# EAGLE design main_controller (EAGLE 5.12)

## Sheet 1 of 2
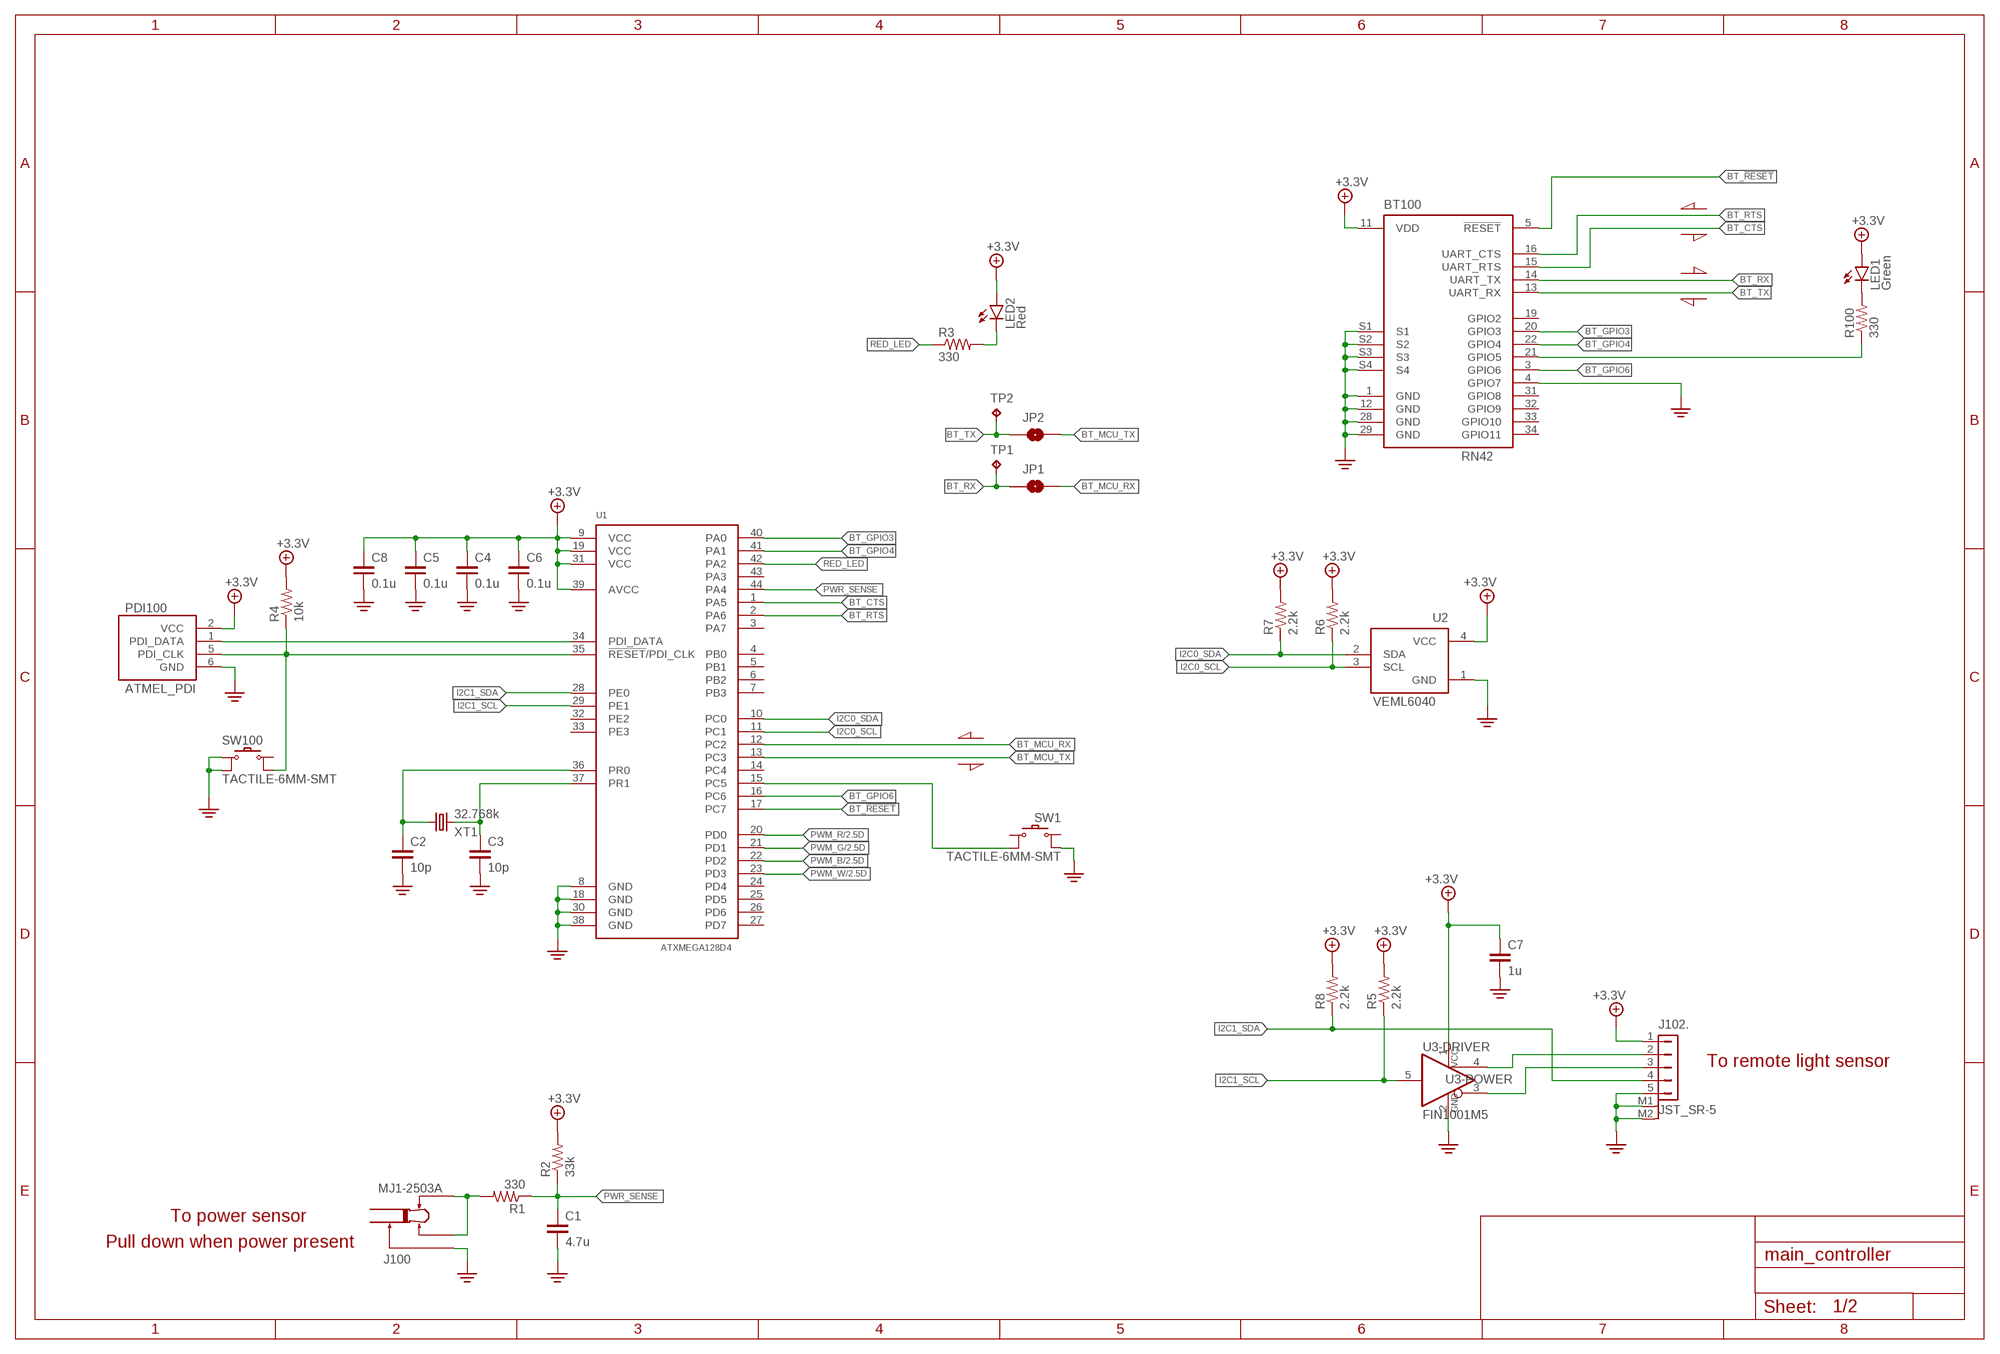
[diagram p0: schematic, sheet 1]

### Parts
BT100  RN42  [RN42]
C1  4.7u  C-CER-0805  [0805]
C2  10p  C-CER-0402  [0402]
C3  10p  C-CER-0402  [0402]
C4  0.1u  C-CER-0603  [0603]
C5  0.1u  C-CER-0603  [0603]
C6  0.1u  C-CER-0603  [0603]
C7  1u  C-CER-0603  [0603]
C8  0.1u  C-CER-0603  [0603]
J100  MJ1-2503A  [MJ1-2503A]
J102  JST_SR-5  [JST_SR-5]
JP1  JP  [SJ]
JP2  JP  [SJ]
LED1  Green  LED-1206  [1206]
LED2  Red  LED-0603  [0603]
PDI100  ATMEL_PDI  [2X03]
R1  330  R-0402  [0402]
R2  33k  R-0402  [0402]
R3  330  R-0805  [0805]
R4  10k  R-0402  [0402]
R5  2.2k  R-0402  [0402]
R6  2.2k  R-0402  [0402]
R7  2.2k  R-0402  [0402]
R8  2.2k  R-0402  [0402]
R100  330  R-0805  [0805]
SW1  TACTILE-6MM-SMT  [TACT-6MM-SMT]
SW100  TACTILE-6MM-SMT  [TACT-6MM-SMT]
TP1  TPTP20R  [TP20R]
TP2  TPTP20R  [TP20R]
U1  ATXMEGA128D4  [TQFP44]
U2  VEML6040  [VEML6040]
U3  FIN1001M5  [SOT23-5]
XT1  32.768k  XT-2.1X6MM  [2.1X6MM]

### Nets
3V3: BT100.11(VDD) C4.1 C5.1 C6.1 C7.1 C8.1 J102.1 LED1.A LED2.A PDI100.2(VCC) R2.2 R4.2 R5.2 R6.2 R7.2 R8.2 U1.9(VCC) U1.19(VCC) U1.31(VCC) U1.39(AVCC) U2.4(VCC) U3.1(-POWER:VCC) ; supply symbol labelled +3.3V ; also sheet 2
BT_!RESET: BT100.5(!RESET) U1.17(PC7)
BT_CTS: BT100.15(UART_RTS) U1.1(PA5)
BT_GPIO3: BT100.20(GPIO3) U1.40(PA0)
BT_GPIO4: BT100.22(GPIO4) U1.41(PA1)
BT_GPIO6: BT100.3(GPIO6) U1.16(PC6)
BT_MCU_RX: JP1.2 U1.12(PC2)
BT_MCU_TX: JP2.2 U1.13(PC3)
BT_RTS: BT100.16(UART_CTS) U1.2(PA6)
BT_RX: BT100.14(UART_TX) JP1.1 TP1.TP
BT_TX: BT100.13(UART_RX) JP2.1 TP2.TP
GND: BT100.1(GND) BT100.4(GPIO7) BT100.12(GND) BT100.28(GND) BT100.29(GND) BT100.S1 BT100.S2 BT100.S3 BT100.S4 C1.2 C2.2 C3.2 C4.2 C5.2 C6.2 C7.2 C8.2 J100.1(GND) J102.5 J102.M1(M) J102.M2(M) PDI100.6(GND) SW1.A2 SW100.A1 SW100.A2 U1.8(GND) U1.18(GND) U1.30(GND) U1.38(GND) U2.1(GND) U3.2(-POWER:GND) ; also sheet 2
I2C0_SCL: R6.1 U1.11(PC1) U2.3(SCL)
I2C0_SDA: R7.1 U1.10(PC0) U2.2(SDA)
I2C1_SCL: R5.1 U1.29(PE1) U3.5(-DRIVER:IN)
I2C1_SDA: J102.4 R8.1 U1.28(PE0)
N$7: BT100.21(GPIO5) R100.1
N$8: LED1.K(C) R100.2
N$9: LED2.K(C) R3.2
N$11: J100.2(MONO) J100.3(MONO) R1.2
N$12: PDI100.1(PDI_DATA) U1.34(PDI_DATA)
N$13: PDI100.5(PDI_CLK) R4.1 SW100.B2 U1.35(!RESET!/PDI_CLK)
N$14: C3.1 U1.37(PR1) XT1.2
N$15: C2.1 U1.36(PR0) XT1.1
N$20: SW1.B2 U1.15(PC5)
PWM_B: U1.22(PD2) ; also sheet 2
PWM_G: U1.21(PD1) ; also sheet 2
PWM_R: U1.20(PD0) ; also sheet 2
PWM_W: U1.23(PD3) ; also sheet 2
PWR_SENSE: C1.1 R1.1 R2.1 U1.44(PA4)
RED_LED: R3.1 U1.42(PA2)
SCL_N: J102.3 U3.3(-DRIVER:OUT-)
SCL_P: J102.2 U3.4(-DRIVER:OUT+)
Unconnected: BT100.19(GPIO2) BT100.31(GPIO8) BT100.32(GPIO9) BT100.33(GPIO10) BT100.34(GPIO11) SW1.A1 SW1.B1 SW100.B1 U1.3(PA7) U1.4(PB0) U1.5(PB1) U1.6(PB2) U1.7(PB3) U1.14(PC4) U1.24(PD4) U1.25(PD5) U1.26(PD6) U1.27(PD7) U1.32(PE2) U1.33(PE3) U1.43(PA3)

### Notes on the sheet
- To remote light sensor
- To power sensor
- Pull down when power present

## Sheet 2 of 2
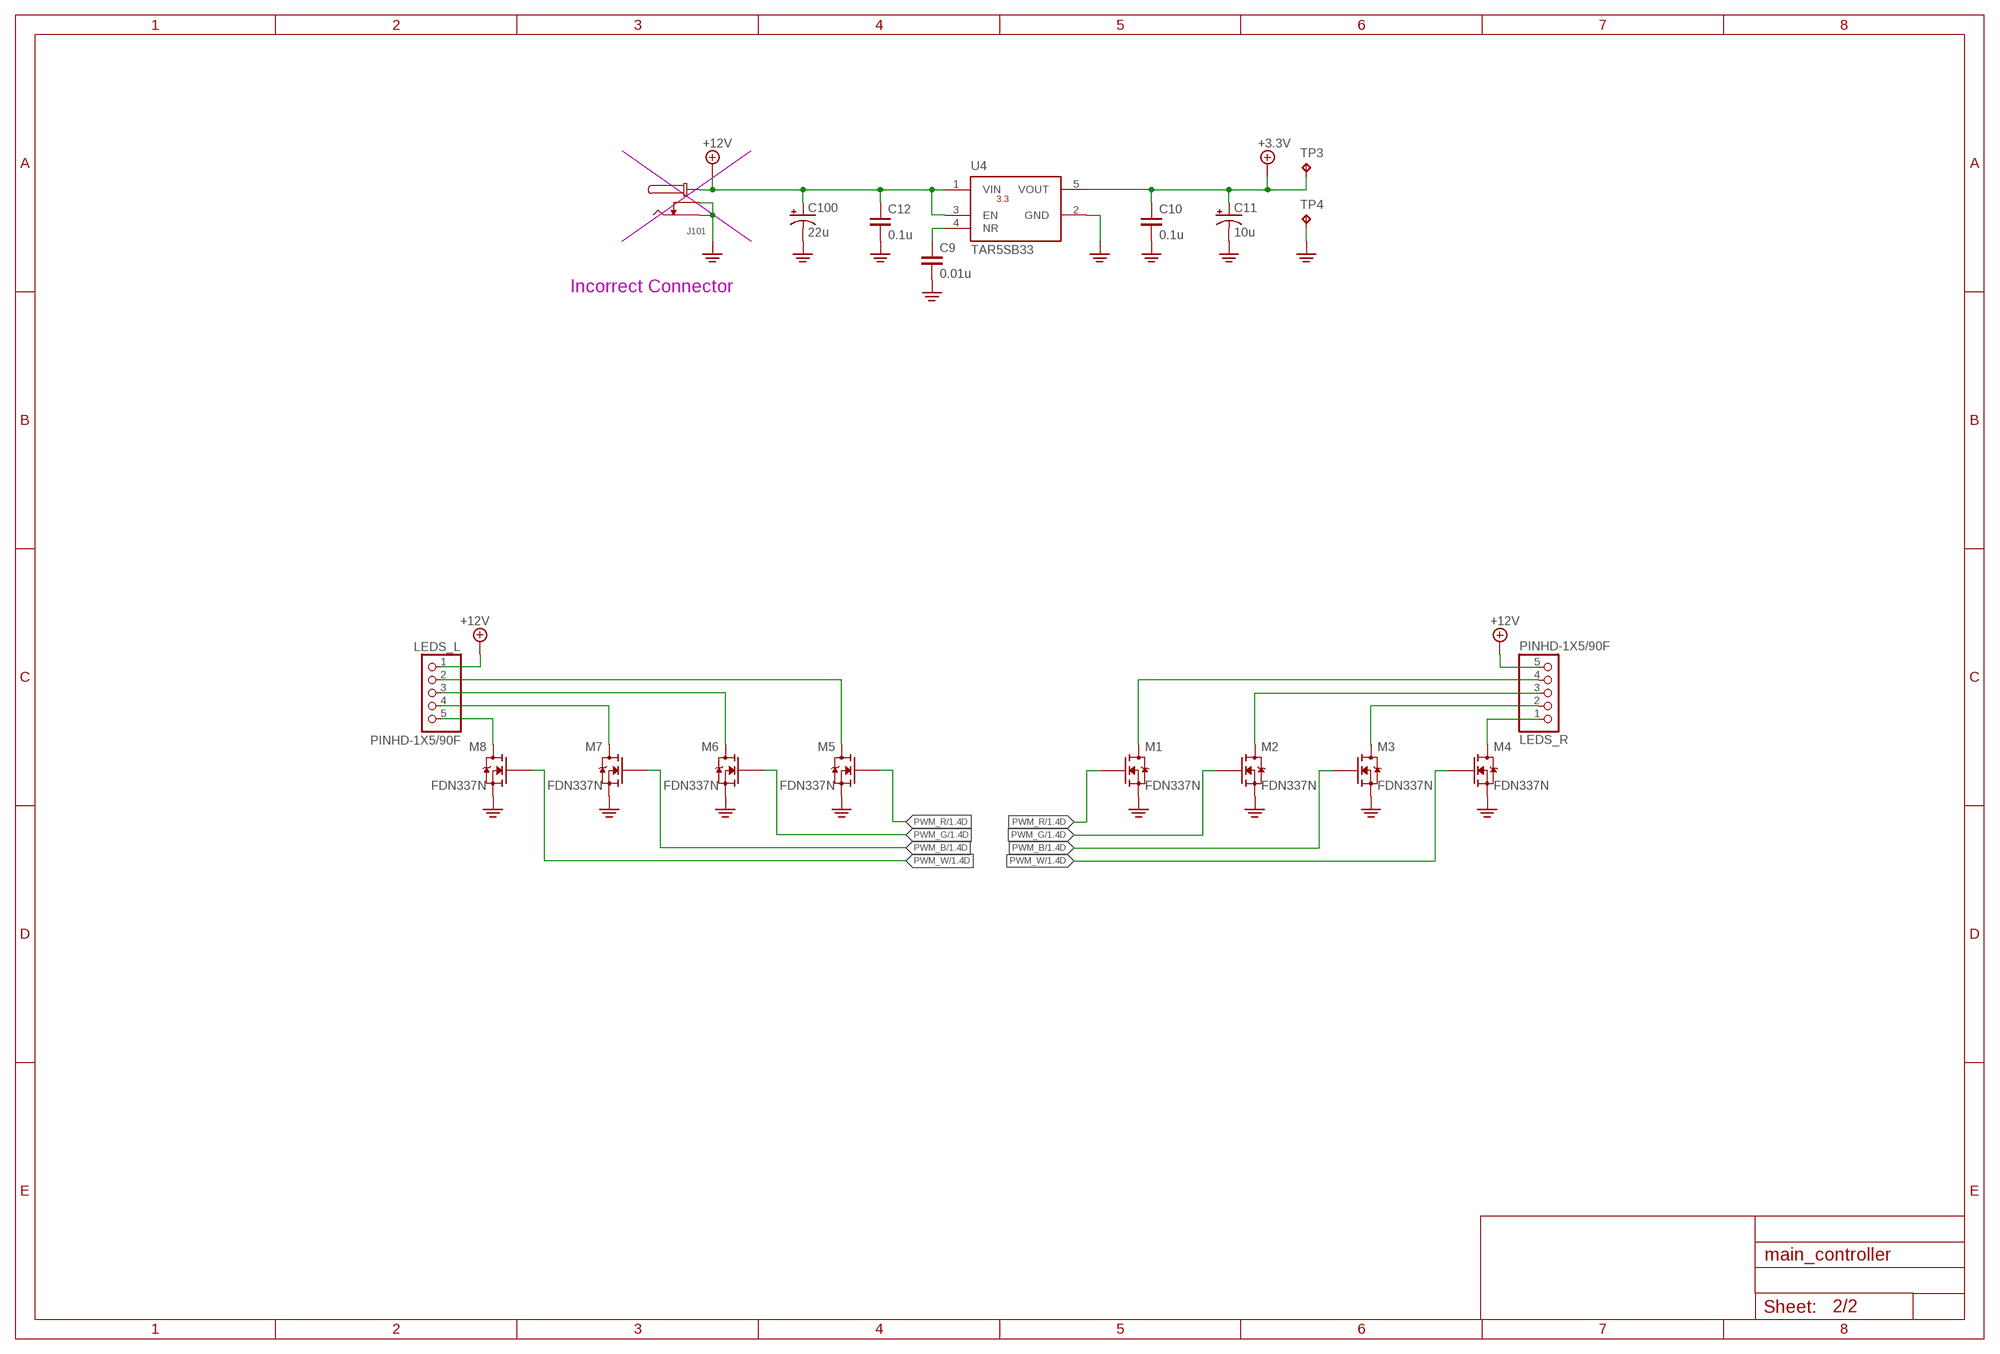
[diagram p1: schematic, sheet 2]

### Parts
C9  0.01u  C-CER-0603  [0603]
C10  0.1u  C-CER-0603  [0603]
C11  10u  C-TANT-3216-18  [KEMET-3216-18]
C12  0.1u  C-CER-1206  [1206]
C100  22u  C-AL-PAN-D  [PANASONIC_D]
J101  EIAJ-03  [PJ1-021-SMD]
LEDS_L  PINHD-1X5/90F  [1X05/90-F]
LEDS_R  PINHD-1X5/90F  [1X05/90-F]
M1  FDN337N  [SOT23]
M2  FDN337N  [SOT23]
M3  FDN337N  [SOT23]
M4  FDN337N  [SOT23]
M5  FDN337N  [SOT23]
M6  FDN337N  [SOT23]
M7  FDN337N  [SOT23]
M8  FDN337N  [SOT23]
TP3  TPTP20R  [TP20R]
TP4  TPTP20R  [TP20R]
U4  TAR5SB33  [SSOP5-P-0.95]

### Nets
3V3: C10.1 C11.+ TP3.TP U4.5(VOUT) ; supply symbol labelled +3.3V ; also sheet 1
12V: C12.1 C100.+ J101.1(CENTER) LEDS_L.1 LEDS_R.5 U4.1(VIN) U4.3(EN) ; supply symbol labelled +12V
GND: C9.2 C10.2 C11.- C12.2 C100.- J101.2(OUTSIDE) J101.3(SW) M1.2(S) M2.2(S) M3.2(S) M4.2(S) M5.2(S) M6.2(S) M7.2(S) M8.2(S) TP4.TP U4.2(GND) ; also sheet 1
N$2: LEDS_L.5 M8.3(D)
N$3: LEDS_L.4 M7.3(D)
N$4: LEDS_L.3 M6.3(D)
N$5: LEDS_L.2 M5.3(D)
N$10: C9.1 U4.4(NR)
N$16: LEDS_R.1 M4.3(D)
N$17: LEDS_R.2 M3.3(D)
N$18: LEDS_R.3 M2.3(D)
N$19: LEDS_R.4 M1.3(D)
PWM_B: M3.1(G) M7.1(G) ; also sheet 1
PWM_G: M2.1(G) M6.1(G) ; also sheet 1
PWM_R: M1.1(G) M5.1(G) ; also sheet 1
PWM_W: M4.1(G) M8.1(G) ; also sheet 1

### Notes on the sheet
- Incorrect Connector

## Library data of the parts
BT100 = aim-rf:RN42
C1-C10 C12 = aim-passives:C-CER
C11 = aim-passives:C-TANT
C100 = aim-passives:C-AL
J100 = aim-connectors:MJ1-2503A
J101 = aim-connectors:EIAJ-03: EIAJ-03 Jack
J102 = aim-connectors:JST_SR-5
JP1 JP2 = aim-passives:JP: SMD solder JUMPER
LED1 LED2 = aim-diodes:LED
LEDS_L LEDS_R = aim-headers:PINHD-1X5: PIN HEADER
M1-M8 = aim-transistor:FDN337N
PDI100 = aim-atmel:ATMEL_PDI: PIN HEADER
R1-R8 R100 = aim-passives:R
SW1 SW100 = aim-switch:TACTILE
TP1-TP4 = testpad:TP: Test pad
U1 = aim-atmel:ATXMEGA*D4
U2 = aim-sensors:VEML6040: Color sensor
U3 = aim-digital:FIN1001M5
U4 = aim-power:TAR5SB*; VOLT: 3.3
XT1 = aim-crystals:XT

## Board
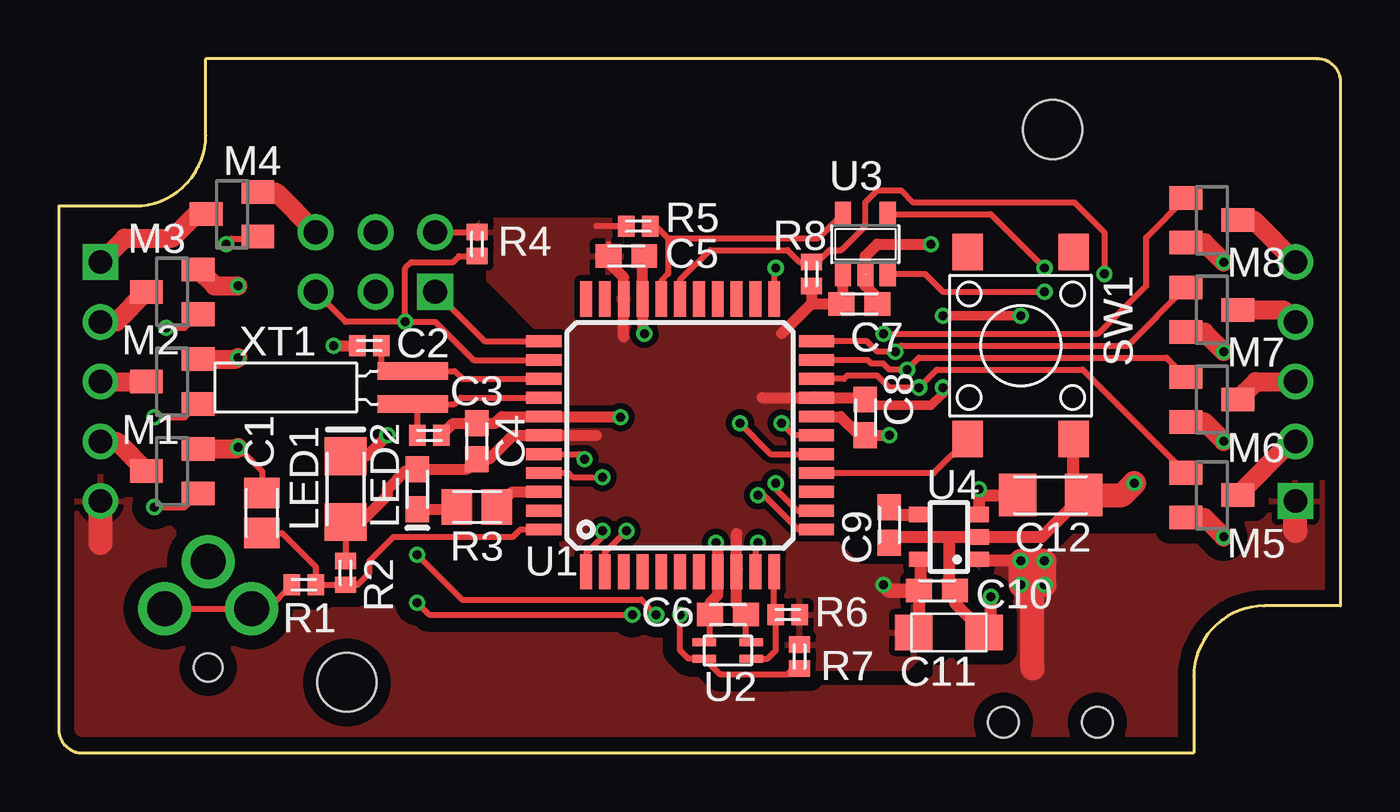
[diagram p2: board, top side]
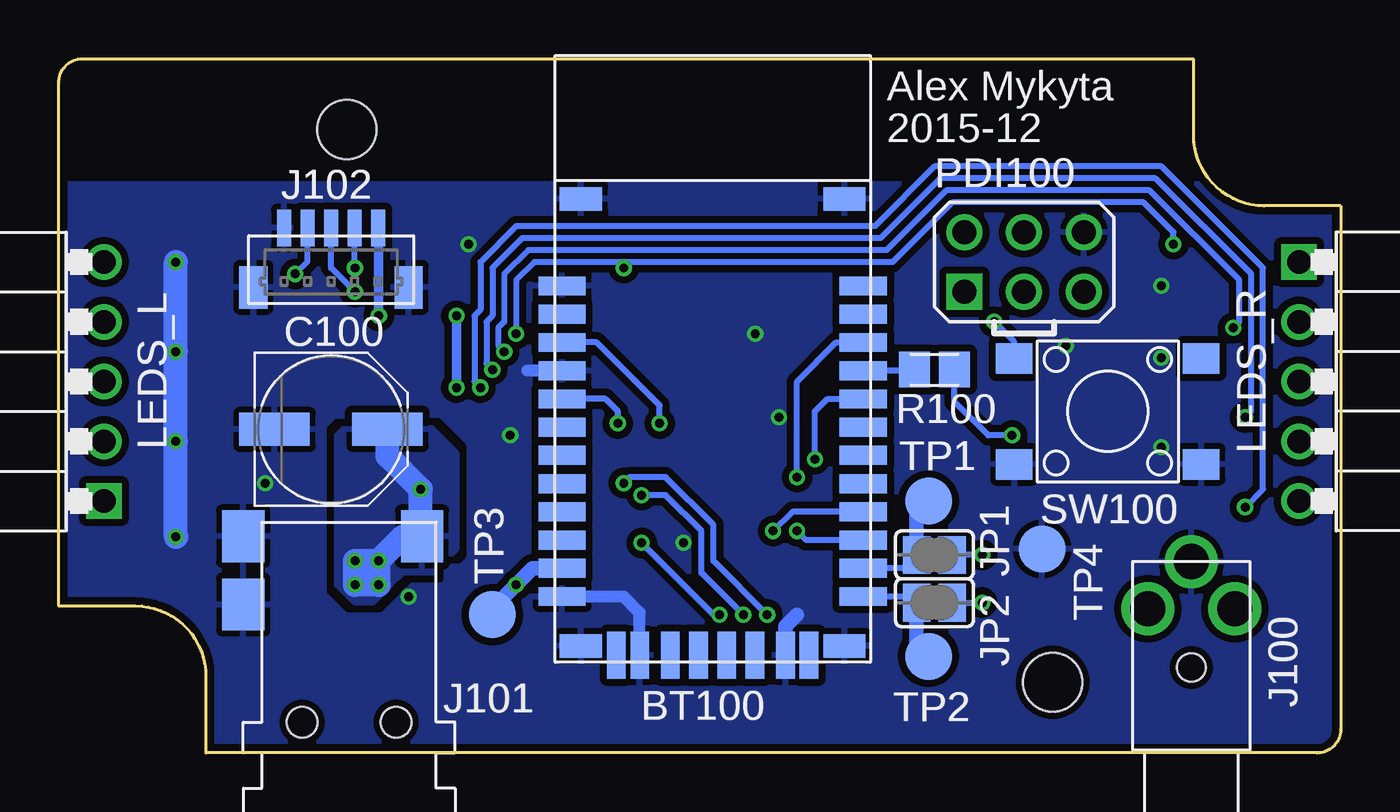
[diagram p3: board, bottom side, seen from below]

Size 54.5 x 29.5 mm. Coordinates in mm from the lower left corner, seen from the top.
Copper layers (1*16): Top 0.035mm / dielectric 1.5mm / Bottom 0.035mm
Design rules "MakerStudio": minimum track width 6mil, minimum drill 12mil, track to track 6mil, track to pad 6mil, pad to pad 6mil, via to via 6mil, smd to smd 0mil, copper to edge 10mil, drill to drill 10mil, minimum pad ring 10mil, minimum via ring 6mil, stop-mask expansion 2mil, vias tented up to drill 100mil, thermal gap 10mil

### Footprints (pad centres in the part's own frame; a part is rotated, then mirrored left to right if it is on the bottom)
RN42 = smd 2 x 0.8: 1 0.3,16; 2 0.3,14.8; 3 0.3,13.6; 4 0.3,12.4; 5 0.3,11.2; 6 0.3,10; 7 0.3,8.8; 8 0.3,7.6; 9 0.3,6.4; 10 0.3,5.2; 11 0.3,4; 12 0.3,2.8; 13 13.1,2.8; 14 13.1,4; 15 13.1,5.2; 16 13.1,6.4; 17 13.1,7.6; 18 13.1,8.8; 19 13.1,10; 20 13.1,11.2; 21 13.1,12.4; 22 13.1,13.6; 23 13.1,14.8; 24 13.1,16 | smd 0.8 x 2: 28 9.8,0.3; 29 3.6,0.3; 30 10.8,0.3; 31 8.5,0.3; 32 7.3,0.3; 33 6.1,0.3; 34 4.9,0.3; 35 2.6,0.3 | smd 1.8 x 1: S1 1.1,0.7; S2 12.3,0.7; S3 1.1,19.7; S4 12.3,19.7
0805 = smd 1.3 x 1.5: 1 -0.85,0; 2 0.85,0
0402 = smd 0.7 x 0.9: 1 -0.508,0; 2 0.508,0
0603 = smd 1.1 x 1: 1 -0.762,0; 2 0.762,0
KEMET-3216-18 = smd 1.6 x 1.5: + 1.5,0; - -1.5,0
1206 = smd 1.6 x 1.8: 1 -1.4,0; 2 1.4,0
PANASONIC_D = smd 3 x 1.4: + 2.4,0; - -2.4,0
MJ1-2503A = drill 1.5 round: 1 2,0; 2 0,-1.85; 3 0,1.85 | hole 1.2: -2.5,0
PJ1-021-SMD = smd 2.2 x 1.8: 1 7.9,-2.6; 2 5,5; 3 7.9,5 | hole 1.3: 0,2.5; 0,-1.5
JST_SR-5 = smd 0.6 x 1.55: 1 2,3.225; 2 1,3.225; 3 0,3.225; 4 -1,3.225; 5 -2,3.225 | smd 1.2 x 1.8: M1 3.3,0.7; M2 -3.3,0.7
SJ = smd 1.168 x 1.6: 1 -0.762,0; 2 0.762,0
1206' = smd 1.6 x 1.8: A -1.4,0; K 1.4,0
0603' = smd 1.1 x 1: A -0.85,0; K 0.85,0
1X05/90-F = drill 1 square: 1 -5.08,0 | drill 1 round: 2 -2.54,0; 3 0,0; 4 2.54,0; 5 5.08,0
SOT23 = smd 1 x 1.4: 1 -0.95,-1.1; 2 0.95,-1.1; 3 0,1.1
2X03 = drill 1.016 square: 1 -2.54,-1.27 | drill 1.016 round: 2 -2.54,1.27; 3 0,-1.27; 4 0,1.27; 5 2.54,-1.27; 6 2.54,1.27
TACT-6MM-SMT = smd 1.55 x 1.3: A1 -3.975,2.25; A2 3.975,2.25; B1 -3.975,-2.25; B2 3.975,-2.25
TP20R = smd 2 x 2: TP 0,0
TQFP44 = smd 1.5 x 0.5: 1 -5.8,4; 2 -5.8,3.2; 3 -5.8,2.4; 4 -5.8,1.6; 5 -5.8,0.8; 6 -5.8,0; 7 -5.8,-0.8; 8 -5.8,-1.6; 9 -5.8,-2.4; 10 -5.8,-3.2; 11 -5.8,-4; 23 5.8,-4; 24 5.8,-3.2; 25 5.8,-2.4; 26 5.8,-1.6; 27 5.8,-0.8; 28 5.8,0; 29 5.8,0.8; 30 5.8,1.6; 31 5.8,2.4; 32 5.8,3.2; 33 5.8,4 | smd 0.5 x 1.5: 12 -4,-5.8; 13 -3.2,-5.8; 14 -2.4,-5.8; 15 -1.6,-5.8; 16 -0.8,-5.8; 17 0,-5.8; 18 0.8,-5.8; 19 1.6,-5.8; 20 2.4,-5.8; 21 3.2,-5.8; 22 4,-5.8; 34 4,5.8; 35 3.2,5.8; 36 2.4,5.8; 37 1.6,5.8; 38 0.8,5.8; 39 0,5.8; 40 -0.8,5.8; 41 -1.6,5.8; 42 -2.4,5.8; 43 -3.2,5.8; 44 -4,5.8
VEML6040 = smd 1 x 0.35: 1 -1,0.35; 2 -1,-0.35; 3 1,-0.35; 4 1,0.35
SOT23-5 = smd 0.69 x 0.99: 1 -0.95,-1.29; 2 0,-1.29; 3 0.95,-1.29; 4 0.95,1.3; 5 -0.95,1.3
SSOP5-P-0.95 = smd 0.65 x 1: 1 -0.95,-1.2; 2 0,-1.2; 3 0.95,-1.2; 4 0.95,1.2; 5 -0.95,1.2
1551JFL = hole 2.5: 12.25,26.5; 42.25,3
2.1X6MM = smd 3 x 0.75: 1 5.4,0.7; 2 5.4,-0.7

### Placement (x,y rotation side)
BT100  33.4,3.85 0 bottom
C1  8.64,10.2 90 top
C2  13.21,17.31 180 top
C3  15.75,13.5 0 top
C4  17.78,13.24 90 top
C5  24.13,21.12 0 top
C6  28.45,5.88 180 top
C7  34.04,19.09 0 top
C8  34.29,14.26 270 top
C9  35.31,9.69 270 top
C10  37.34,6.89 0 top
C11  37.85,5.12 180 top
C12  42.16,10.96 0 top
C100  42.93,13.75 0 bottom
J100  6.35,6.13 90 bottom
J101  41.66,1.31 90 bottom
J102  42.93,19.09 0 bottom
JP1  17.27,8.42 0 bottom
JP2  17.27,6.39 0 bottom
LED1  Green  [1206']  12.19,11.21 90 top
LED2  Red  [0603']  15.24,11.21 270 top
LEDS_L  52.58,15.78 90 bottom
LEDS_R  1.78,15.78 270 bottom
M1  4.83,11.97 90 top
M2  4.83,15.78 90 top
M3  4.83,19.59 90 top
M4  7.37,22.9 90 top
M5  49.02,10.96 270 top
M6  49.02,15.02 270 top
M7  49.02,18.83 270 top
M8  49.02,22.64 270 top
PDI100  13.46,20.86 0 bottom
R1  10.41,7.15 180 top
R2  12.19,7.66 90 top
R3  17.78,10.45 180 top
R4  17.78,21.63 90 top
R5  24.64,22.39 180 top
R6  30.99,5.88 0 top
R7  31.5,4.1 90 top
R8  32,20.36 270 top
R100  17.27,16.29 0 bottom
SW1  40.89,17.31 270 top
SW100  9.91,14.51 180 bottom
TP1  17.53,10.7 0 bottom
TP2  17.53,4.1 0 bottom
TP3  36.07,5.88 0 bottom
TP4  12.7,8.67 0 bottom
U1  26.42,13.5 90 top
U2  28.45,4.35 0 top
U3  34.29,21.63 0 top
U4  37.85,9.18 90 top
U$100  [1551JFL]  0,29.5 180 bottom
XT1  9.65,15.53 0 top

### Tracks (layer width: path | path; a pad name or v marks a point on that pad's centre or on a via)
3V3  (via drill 0.38)
  Top 0.254: PDI100.2 R4.2 | LED1.A R2.2 | 15.15,11.97 LED2.A | C6.1 29.21,4.94 U2.4 | C5.1 23.37,21.63 | R5.2 22.86,22.39
  Top 0.406: v37.59,18.58 v40.89,18.58 | v37.59,15.53 37.59,15.28 37.08,14.77 34.54,14.77 C8.1
  Top 0.457: C5.1 23.37,20.86 24.02,20.22 U1.31 24.02,17.68 | 22.86,13.5 U1.39 19.3,13.5 18.29,12.48 C4.1 17.36,12.06 LED2.A | 29.9,15.1 U1.19 34.21,15.1 C8.1 | 28.82,9.32 U1.9 28.82,6.27 C6.1 | LED1.A 12.82,9.81 13.97,10.96 13.97,11.21 14.73,11.97 15.15,11.97 | R8.2 32,19.09 | 32,19.09 30.73,17.82 | U3.1 33.34,19.15 C7.1 32,19.09
  Top 0.508: U4.5 36.65,6.96 C10.1 36.58,5.35 C11.+
  Top 0.61: v35.05,7.15 35.31,6.89 C10.1
  Bottom 0.254: 40.89,22.28 J102.1
  Bottom 0.406: v37.59,15.53 v37.59,18.58 | v40.89,18.58 40.89,22.28
  Bottom 0.61: BT100.11 34.35,7.85 v35.05,7.15 36.07,6.13 TP3.TP
  pour Top (isolate 0.254): 20.83,17.56 18.29,20.1 18.29,21.37 17.78,21.88 17.78,22.39 18.03,22.64 23.88,22.64 23.88,20.36 25.15,19.09 29.72,19.09 32,16.8 32,9.94 34.04,7.91 36.58,7.91 36.58,4.1 36.07,3.59 31.5,3.59 30.48,4.61 30.48,7.91 22.35,7.91 20.83,9.43
12V  (via drill 0.38)
  Top 0.254: 39.12,10.2 U4.3 | 39.11,8.16 U4.1 | 41.4,7.15 v40.89,7.15
  Top 0.508: C12.1 39.37,10.96 v39.12,11.21 39.12,10.2 | v40.89,8.16 39.11,8.16
  Top 1.016: v40.89,7.15 v40.89,8.16 v41.91,8.16 v41.91,7.15 41.4,7.15 41.4,3.59 | 52.58,9.43 LEDS_L.1 | 1.78,8.93 LEDS_R.5
  Bottom 0.254: J101.1 39.12,9.27
  Bottom 1.016: C100.+ 40.53,12.62 v39.12,11.21 39.12,9.27 | J101.1 39.85,9.21 v40.89,8.16 | v40.89,8.16 v41.91,8.16 v41.91,7.15 v40.89,7.15 v40.89,8.16
  pour Top (isolate 0.61, rank 2): 1.02,11.72 0,10.7 0,0.04 54.61,0.04 54.61,11.47 51.82,11.47 49.53,9.18 39.12,9.18 39.12,7.66 40.13,6.64 40.13,6.13 37.59,3.59 27.94,3.59 25.4,6.13 8.13,6.13 2.54,11.72
  pour Bottom (isolate 0.457): 39.12,14.26 37.59,12.74 37.59,8.67 38.61,7.66 39.88,7.66 41.15,6.39 41.91,6.39 42.67,7.15 42.67,13.5 41.91,14.26
BT_!RESET  (via drill 0.38)
  Top 0.254: v30.73,14.01 31.24,13.5 U1.17
  Bottom 0.254: BT100.5 31.27,15.05 30.73,14.51 v30.73,14.01
BT_CTS  (via drill 0.38)
  Top 0.254: U1.1 22.42,8.48 23.11,9.18 v23.11,9.43
  Bottom 0.254: BT100.15 22.73,9.05 v23.11,9.43
BT_GPIO3  (via drill 0.38)
  Top 0.254: U1.40 22.14,12.7 v22.35,12.48
  Bottom 0.254: v22.35,12.48 22.35,14.51 21.82,15.05 BT100.20
BT_GPIO4  (via drill 0.38)
  Top 0.254: U1.41 21.67,11.9 21.84,11.72 v23.11,11.72
  Bottom 0.254: v23.11,11.72 23.11,15.78 21.45,17.45 BT100.22
BT_GPIO6  (via drill 0.38)
  Top 0.254: U1.16 30.26,12.7 v28.96,14.01
  Bottom 0.254: v28.96,14.01 28.96,14.77 31.63,17.45 BT100.3
BT_MCU_RX  (via drill 0.38)
  Top 0.254: U1.12 31.43,9.5 29.97,10.96 v29.72,10.96 | v15.24,8.42 17.14,6.51 24.77,6.51 v25.4,5.88
  Bottom 0.254: v29.72,10.96 28.7,10.96 27.18,9.43 27.18,7.66 v25.4,5.88 | v15.24,8.42 JP1.2
BT_MCU_TX  (via drill 0.38)
  Top 0.254: U1.13 31.39,10.3 30.48,11.21 v30.48,11.47 | v15.24,6.39 15.75,5.88 v24.38,5.88
  Bottom 0.254: v30.48,11.47 30.23,11.72 28.7,11.72 26.67,9.69 26.67,8.16 v24.38,5.88 | JP2.2 v15.24,6.39
BT_RTS  (via drill 0.38)
  Top 0.254: U1.2 23.22,8.52 v24.13,9.43
  Bottom 0.254: BT100.16 23.32,10.25 v24.13,9.43
BT_RX
  Bottom 0.254: BT100.14 18.61,7.85 JP1.1
  Bottom 0.61: JP1.1 18.03,10.2 TP1.TP
BT_TX
  Bottom 0.254: BT100.13 18.29,6.65 JP2.1
  Bottom 0.61: JP2.1 18.03,4.61 TP2.TP
GND  (via drill 0.38)
  Top 0.254: C1.2 8.64,11.97 v7.62,12.99 | C6.2 27.69,4.94 U2.1 | 23.84,14.3 23.88,14.3 v23.88,14.26
  Top 0.457: C3.2 16.76,14.01 C4.2 18.54,14.01 18.83,14.3 U1.38 23.84,14.3 | C5.2 24.82,21.04 U1.30 24.82,17.89 v24.89,17.82 | v11.68,17.31 C2.2 | v27.94,8.93 28.02,8.85 U1.8 28.02,6.72 27.69,6.39 C6.2 | U1.18 33.24,14.3 34.04,13.5 C8.2 v35.31,13.5 | v37.08,21.63 34.8,21.63 34.29,21.12 U3.2 34.29,19.85 34.8,19.34 C7.2
  Top 0.508: C9.2 35.56,9.18 37.85,9.18 | 37.85,9.18 U4.2 41.79,9.18 C12.2 43.14,11.38 SW1.A2 | 37.85,9.18 37.85,7.15 C10.2 38.1,6.36 C11.- 39.62,5.39 v39.62,6.64
  Top 0.813: M8.2 48.7,21.69 v49.53,20.86 | M7.2 48.7,17.88 v49.53,17.05 | M6.2 48.7,14.07 v49.53,13.24 | M5.2 48.7,10.01 v49.53,9.18 | M3.2 6.62,19.85 v7.62,19.85 | v7.62,12.99 7.55,12.92 M1.2 | v7.62,16.8 7.55,16.73 M2.2 | PDI100.6 9.21,23.85 M4.2
  Top 1.016: C12.2 45.21,10.96 v45.72,11.47
  Bottom 0.508: BT100.29 29.8,5.96 30.48,6.64 BT100.12 | BT100.4 34.59,16.25
  Bottom 0.61: BT100.28 23.6,5.39 23.11,5.88
  Bottom 1.016: v49.53,20.86 v49.53,17.05 v49.53,13.24 v49.53,9.18 49.5,9.21
  pour Bottom (isolate 0.305, rank 2): 0,24.17 54.61,24.17 54.61,0.04 0,0.04
I2C0_SCL
  Top 0.254: U1.11 30.42,5.94 R6.1 30.48,4.35 30.13,4 U2.3
I2C0_SDA  (via drill 0.38)
  Top 0.254: v26.42,5.88 26.42,4.35 26.77,4 U2.2 28.11,3.34 30.99,3.34 31.24,3.59 R7.1 | U1.10 29.62,8.82 v29.72,8.93
  Bottom 0.254: v26.42,5.88 26.67,5.88 v29.72,8.93
I2C1_SCL
  Top 0.254: U1.29 25.62,20.06 25.91,20.36 25.91,21.88 | 25.33,22.2 R5.1 25.4,22.39 25.91,21.88 | U3.5 32.29,21.88 25.91,21.88
I2C1_SDA  (via drill 0.38)
  Top 0.254: U1.28 26.42,20.1 27.69,21.37 30.99,21.37 31.5,20.86 R8.1 32.26,20.86 32.77,21.37 33.27,21.37 34.29,22.39 34.29,23.4 34.8,23.91 35.81,23.91 36.32,23.4 43.18,23.4 44.45,22.13 v44.45,20.36
  Bottom 0.254: v44.45,20.36 43.93,20.88 J102.4
N$2
  Top 0.813: M8.3 50.8,22.64 LEDS_L.5
N$3
  Top 0.813: M7.3 52.07,18.83 LEDS_L.4
N$4
  Top 0.813: M6.3 50.88,15.78 LEDS_L.3
N$5
  Top 0.813: M5.3 52.41,13.24 LEDS_L.2
N$7
  Bottom 0.254: BT100.21 18.17,16.25 R100.1
N$8  (via drill 0.38)
  Top 0.457: LED1.K 13.08,12.61 v13.97,13.5
  Bottom 0.254: v13.97,13.5 14.99,13.5 16.42,14.93 R100.2
N$9
  Top 0.457: LED2.K 16.84,10.36 R3.2
N$10
  Top 0.508: U4.4 35.63,10.13 C9.1
N$11
  Top 0.254: J100.2 J100.3 8.89,6.13 R1.2
N$12
  Top 0.254: U1.34 18.1,17.5 PDI100.1
N$13  (via drill 0.38)
  Top 0.254: U1.35 17.63,16.7 16,18.32 v14.73,18.32 | PDI100.5 12.19,18.32 v14.73,18.32 | R4.1 17.02,21.12 16.76,20.86 14.99,20.86 14.73,20.61 v14.73,18.32
  Bottom 0.254: 14.7,18.29 v14.73,18.32 13.88,17.47 SW100.B2
N$14
  Top 0.254: U1.37 17.09,15.1 16.83,14.83 XT1.2 15.24,14.64 C3.1
N$15
  Top 0.254: U1.36 17.16,15.9 16.83,16.23 XT1.1 | XT1.1 14.99,16.3 | C2.1 13.72,16.23 XT1.1
N$16
  Top 0.254: 5.84,22.9 M4.3
  Top 0.813: 5.84,22.9 4.83,21.88 2.79,21.88 LEDS_R.1
N$17
  Top 0.813: M3.3 2.46,18.32 LEDS_R.2
N$18
  Top 0.813: LEDS_R.3 M2.3
N$19
  Top 0.813: M1.3 2.46,13.24 LEDS_R.4
N$20
  Top 0.254: U1.15 37.21,11.9 SW1.B2
PWM_B  (via drill 0.38)
  Top 0.254: M3.1 5.35,18.07 v4.57,18.07 | U1.22 34.35,17.5 34.8,17.05 v35.56,17.05 35.81,17.31 45.45,17.31 M7.1
  Bottom 0.254: v4.57,18.07 4.32,18.32 4.32,20.1 8.13,23.91 16.76,23.91 19.3,21.37 34.54,21.37 35.56,20.36 35.56,18.32 35.81,18.07 35.81,17.31 v35.56,17.05
PWM_G  (via drill 0.38)
  Top 0.254: M2.1 5.35,14.26 v4.06,14.26 | M6.1 47.09,16.8 36.58,16.8 v36.07,16.29 35.31,16.29 35.05,16.55 34.54,16.55 34.39,16.7 U1.21
  Bottom 0.254: v4.06,14.26 3.81,14.51 3.81,20.36 7.87,24.42 17.02,24.42 19.56,21.88 34.8,21.88 36.07,20.61 36.07,18.58 36.32,18.32 36.32,16.55 v36.07,16.29
PWM_R  (via drill 0.38)
  Top 0.254: M1.1 5.35,10.45 v4.06,10.45 | U1.20 33.39,15.9 33.53,16.04 34.8,16.04 35.31,15.53 v36.58,15.53 37.34,16.29 43.54,16.29 M5.1
  Bottom 0.254: v4.06,10.45 3.3,11.21 3.3,20.61 7.62,24.93 17.27,24.93 19.81,22.39 35.05,22.39 36.58,20.86 36.58,18.83 36.83,18.58 36.83,15.78 v36.58,15.53
PWM_W  (via drill 0.38)
  Top 0.254: M4.1 8.38,21.86 7.35,21.86 v7.11,21.63 | U1.23 30.42,20.55 v30.48,20.61 | v35.05,17.82 44.2,17.82 46.23,19.85 46.23,21.9 M8.1
  Bottom 0.254: v7.11,21.63 7.11,22.13 8.38,23.4 16.51,23.4 19.05,20.86 30.48,20.86 | v35.05,17.82 35.05,20.1 34.29,20.86 30.48,20.86 | 30.48,20.86 v30.48,20.61
PWR_SENSE
  Top 0.254: C1.1 9.49,9.35 10.92,7.91 R1.1 R2.1 12.7,7.15 13.21,7.66 13.21,8.16 14.22,9.18 19.3,9.18 19.62,9.5 U1.44
RED_LED
  Top 0.457: U1.42 19.28,11.1 R3.1
SCL_N  (via drill 0.38)
  Top 0.254: U3.3 35.26,20.36 36.83,20.36 37.59,19.59 v41.91,19.59
  Bottom 0.254: v41.91,19.59 42.93,20.61 J102.3
SCL_P  (via drill 0.38)
  Top 0.254: U3.4 35.27,22.9 39.62,22.9 v41.91,20.61
  Bottom 0.254: v41.91,20.61 41.93,20.63 J102.2

### Text on the board
_tPlace: U2
_bPlace: Alex Mykyta | 2015-12 | BT100
_tNames: M4 | U3 | R5 | M3 | R4 | C5 | R8 | SW1 | M8 | M2 | XT1 | C2 | C7 | C8 | M7 | C3 | C4 | M1 | C1 | M6 | U4 | LED2 | LED1 | R3 | U1 | C12 | R2 | C9 | M5 | R1 | C10 | C6 | R6 | C11 | R7
_bNames: PDI100 | J102 | LEDS_L | C100 | R100 | LEDS_R | TP1 | SW100 | JP1 | TP4 | JP2 | TP3 | J100 | J101 | TP2